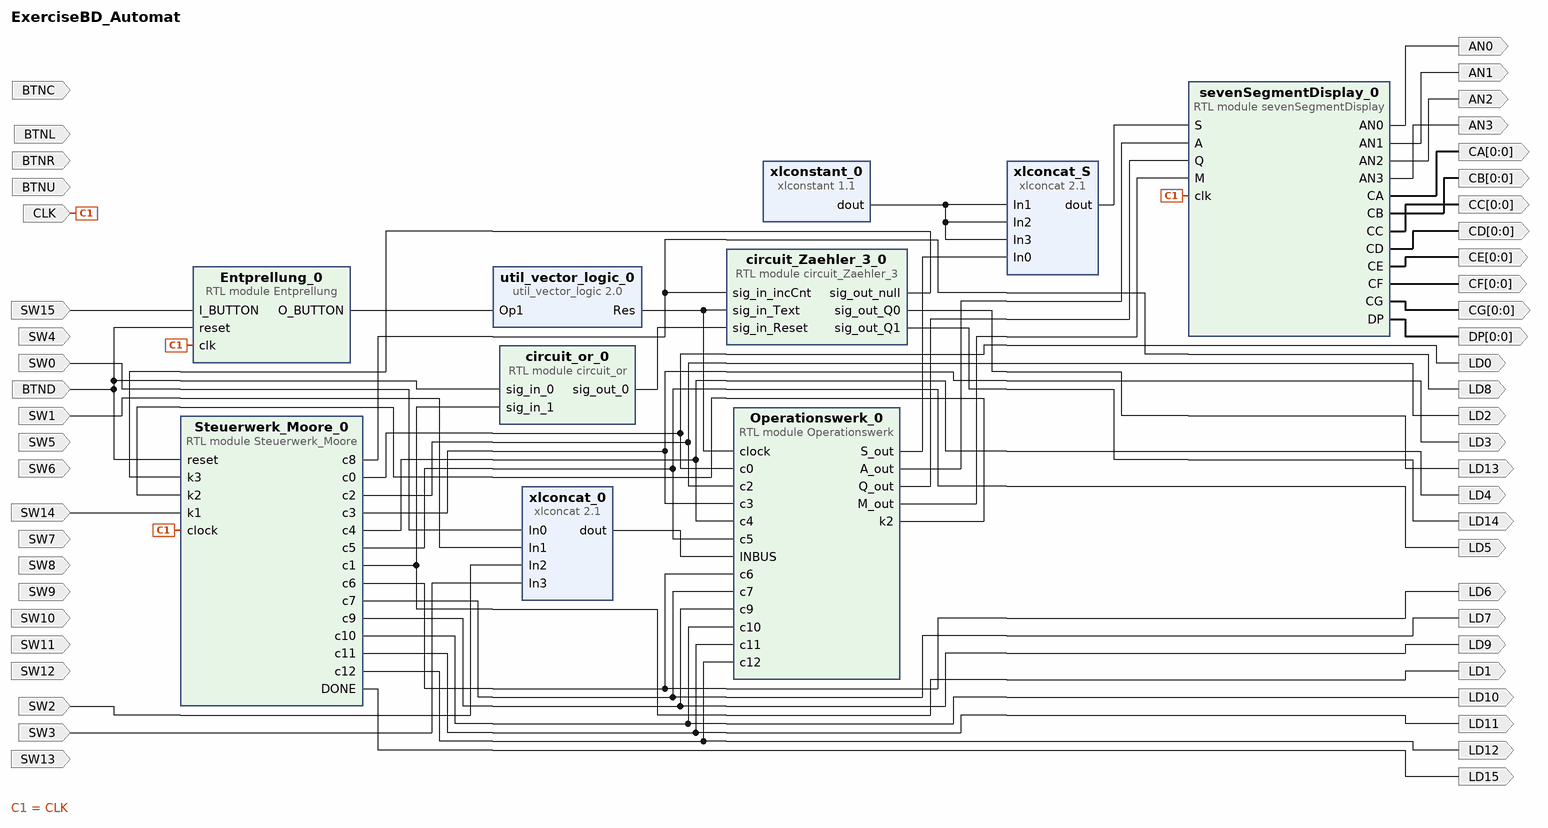
[diagram p0: block diagram of the top level]
# Vivado block design ExerciseBD_Automat, xcvc1802-viva1596-1LHP-i-L, Vivado 2020.3
create_bd_design ExerciseBD_Automat

create_bd_port -dir I BTNR
create_bd_port -dir I BTNC
create_bd_port -dir I BTNU
create_bd_port -dir I SW14
create_bd_port -dir I SW13
create_bd_port -dir I -type rst SW12
create_bd_port -dir I BTNL
create_bd_port -dir I SW6
create_bd_port -dir I SW7
create_bd_port -dir I SW8
create_bd_port -dir I SW9
create_bd_port -dir I SW10
create_bd_port -dir I SW11
create_bd_port -dir I SW4
create_bd_port -dir I BTND
create_bd_port -dir I -type clk CLK
set_property -dict {CONFIG.ASSOCIATED_RESET reset_clk:SW0:BTND CONFIG.CLK_DOMAIN CLK} [get_bd_ports CLK]
create_bd_port -dir O AN0
create_bd_port -dir O AN1
create_bd_port -dir O AN2
create_bd_port -dir O AN3
create_bd_port -dir O -from 0 -to 0 CA
create_bd_port -dir O -from 0 -to 0 CB
create_bd_port -dir O -from 0 -to 0 CC
create_bd_port -dir O -from 0 -to 0 CD
create_bd_port -dir O -from 0 -to 0 CE
create_bd_port -dir O -from 0 -to 0 CF
create_bd_port -dir O -from 0 -to 0 CG
create_bd_port -dir O -from 0 -to 0 DP
create_bd_port -dir I SW15
create_bd_port -dir O LD0
create_bd_port -dir O LD1
create_bd_port -dir O LD2
create_bd_port -dir O LD3
create_bd_port -dir O LD4
create_bd_port -dir O LD5
create_bd_port -dir O LD6
create_bd_port -dir O LD7
create_bd_port -dir O LD8
create_bd_port -dir O LD9
create_bd_port -dir O LD10
create_bd_port -dir O LD11
create_bd_port -dir O LD12
create_bd_port -dir I SW0
create_bd_port -dir I SW1
create_bd_port -dir I SW2
create_bd_port -dir I SW3
create_bd_port -dir O LD15
create_bd_port -dir I SW5
create_bd_port -dir O LD13
create_bd_port -dir O LD14

create_bd_cell -type module -reference Steuerwerk_Moore Steuerwerk_Moore_0
create_bd_cell -type module -reference circuit_Zaehler_3 circuit_Zaehler_3_0
create_bd_cell -type module -reference circuit_or circuit_or_0
create_bd_cell -type module -reference Entprellung Entprellung_0
create_bd_cell -type module -reference Operationswerk Operationswerk_0
create_bd_cell -type module -reference sevenSegmentDisplay sevenSegmentDisplay_0
create_bd_cell -type ip -vlnv xilinx.com:ip:util_vector_logic:2.0 util_vector_logic_0
set_property -dict {CONFIG.C_OPERATION not CONFIG.C_SIZE 1} [get_bd_cells util_vector_logic_0]
create_bd_cell -type ip -vlnv xilinx.com:ip:xlconcat:2.1 xlconcat_0
set_property -dict {CONFIG.NUM_PORTS 4 CONFIG.dout_width 4} [get_bd_cells xlconcat_0]
create_bd_cell -type ip -vlnv xilinx.com:ip:xlconcat:2.1 xlconcat_S
set_property -dict {CONFIG.NUM_PORTS 4 CONFIG.dout_width 4} [get_bd_cells xlconcat_S]
create_bd_cell -type ip -vlnv xilinx.com:ip:xlconstant:1.1 xlconstant_0
set_property -dict {CONFIG.CONST_VAL 0} [get_bd_cells xlconstant_0]

# ---- connections ----

connect_bd_net [get_bd_ports CLK] [get_bd_pins Steuerwerk_Moore_0/clock] [get_bd_pins Entprellung_0/clk] [get_bd_pins sevenSegmentDisplay_0/clk]
connect_bd_net [get_bd_pins xlconstant_0/dout] [get_bd_pins xlconcat_S/In1] [get_bd_pins xlconcat_S/In2] [get_bd_pins xlconcat_S/In3]
connect_bd_net [get_bd_pins sevenSegmentDisplay_0/AN0] [get_bd_ports AN0]
connect_bd_net [get_bd_pins sevenSegmentDisplay_0/AN1] [get_bd_ports AN1]
connect_bd_net [get_bd_pins sevenSegmentDisplay_0/AN2] [get_bd_ports AN2]
connect_bd_net [get_bd_pins sevenSegmentDisplay_0/AN3] [get_bd_ports AN3]
connect_bd_net [get_bd_pins sevenSegmentDisplay_0/CA] [get_bd_ports CA]
connect_bd_net [get_bd_pins sevenSegmentDisplay_0/CB] [get_bd_ports CB]
connect_bd_net [get_bd_pins sevenSegmentDisplay_0/CC] [get_bd_ports CC]
connect_bd_net [get_bd_pins sevenSegmentDisplay_0/CD] [get_bd_ports CD]
connect_bd_net [get_bd_pins sevenSegmentDisplay_0/CE] [get_bd_ports CE]
connect_bd_net [get_bd_pins sevenSegmentDisplay_0/CF] [get_bd_ports CF]
connect_bd_net [get_bd_pins sevenSegmentDisplay_0/CG] [get_bd_ports CG]
connect_bd_net [get_bd_pins sevenSegmentDisplay_0/DP] [get_bd_ports DP]
connect_bd_net [get_bd_pins xlconcat_S/dout] [get_bd_pins sevenSegmentDisplay_0/S]
connect_bd_net -net SW15_1 [get_bd_ports SW15] [get_bd_pins Entprellung_0/I_BUTTON]
connect_bd_net [get_bd_pins Entprellung_0/O_BUTTON] [get_bd_pins util_vector_logic_0/Op1]
connect_bd_net [get_bd_pins util_vector_logic_0/Res] [get_bd_pins circuit_Zaehler_3_0/sig_in_Text] [get_bd_pins Operationswerk_0/clock]
connect_bd_net -net Operationswerk_0_F_out [get_bd_pins Operationswerk_0/S_out] [get_bd_pins xlconcat_S/In0]
connect_bd_net [get_bd_pins Operationswerk_0/A_out] [get_bd_pins sevenSegmentDisplay_0/A]
connect_bd_net [get_bd_pins Operationswerk_0/Q_out] [get_bd_pins sevenSegmentDisplay_0/Q]
connect_bd_net [get_bd_pins Operationswerk_0/M_out] [get_bd_pins sevenSegmentDisplay_0/M]
connect_bd_net [get_bd_pins xlconcat_0/dout] [get_bd_pins Operationswerk_0/INBUS]
connect_bd_net -net SW0_1 [get_bd_ports SW0] [get_bd_pins xlconcat_0/In0]
connect_bd_net -net SW1_1 [get_bd_ports SW1] [get_bd_pins xlconcat_0/In1]
connect_bd_net -net SW2_1 [get_bd_ports SW2] [get_bd_pins xlconcat_0/In2]
connect_bd_net -net SW3_1 [get_bd_ports SW3] [get_bd_pins xlconcat_0/In3]
connect_bd_net [get_bd_ports BTND] [get_bd_pins circuit_or_0/sig_in_0] [get_bd_pins Steuerwerk_Moore_0/reset] [get_bd_pins Entprellung_0/reset]
connect_bd_net [get_bd_pins Steuerwerk_Moore_0/c0] [get_bd_ports LD0] [get_bd_pins Operationswerk_0/c0]
connect_bd_net [get_bd_pins Steuerwerk_Moore_0/c2] [get_bd_ports LD2] [get_bd_pins Operationswerk_0/c2]
connect_bd_net [get_bd_pins Steuerwerk_Moore_0/c3] [get_bd_ports LD3] [get_bd_pins Operationswerk_0/c3]
connect_bd_net [get_bd_pins Steuerwerk_Moore_0/c4] [get_bd_ports LD4] [get_bd_pins Operationswerk_0/c4]
connect_bd_net [get_bd_pins Steuerwerk_Moore_0/c5] [get_bd_ports LD5] [get_bd_pins Operationswerk_0/c5]
connect_bd_net [get_bd_pins Steuerwerk_Moore_0/c6] [get_bd_ports LD6] [get_bd_pins Operationswerk_0/c6]
connect_bd_net [get_bd_pins Steuerwerk_Moore_0/c7] [get_bd_ports LD7] [get_bd_pins Operationswerk_0/c7]
connect_bd_net [get_bd_pins Steuerwerk_Moore_0/c9] [get_bd_ports LD9] [get_bd_pins Operationswerk_0/c9]
connect_bd_net [get_bd_pins Steuerwerk_Moore_0/c10] [get_bd_ports LD10] [get_bd_pins Operationswerk_0/c10]
connect_bd_net [get_bd_pins Steuerwerk_Moore_0/c11] [get_bd_ports LD11] [get_bd_pins Operationswerk_0/c11]
connect_bd_net [get_bd_pins Steuerwerk_Moore_0/c12] [get_bd_ports LD12] [get_bd_pins Operationswerk_0/c12]
connect_bd_net [get_bd_pins Steuerwerk_Moore_0/DONE] [get_bd_ports LD15]
connect_bd_net [get_bd_pins circuit_Zaehler_3_0/sig_out_Q0] [get_bd_ports LD13]
connect_bd_net [get_bd_pins circuit_Zaehler_3_0/sig_out_Q1] [get_bd_ports LD14]
connect_bd_net [get_bd_pins circuit_Zaehler_3_0/sig_out_null] [get_bd_pins Steuerwerk_Moore_0/k3]
connect_bd_net [get_bd_pins Operationswerk_0/k2] [get_bd_pins Steuerwerk_Moore_0/k2]
connect_bd_net [get_bd_pins Steuerwerk_Moore_0/c1] [get_bd_pins circuit_or_0/sig_in_1] [get_bd_ports LD1]
connect_bd_net [get_bd_pins circuit_or_0/sig_out_0] [get_bd_pins circuit_Zaehler_3_0/sig_in_Reset]
connect_bd_net -net SW14_1 [get_bd_ports SW14] [get_bd_pins Steuerwerk_Moore_0/k1]
connect_bd_net [get_bd_pins Steuerwerk_Moore_0/c8] [get_bd_pins circuit_Zaehler_3_0/sig_in_incCnt] [get_bd_ports LD8]

validate_bd_design
save_bd_design
